# EAGLE design PitotCTRLboard3 (EAGLE 9.6.2)
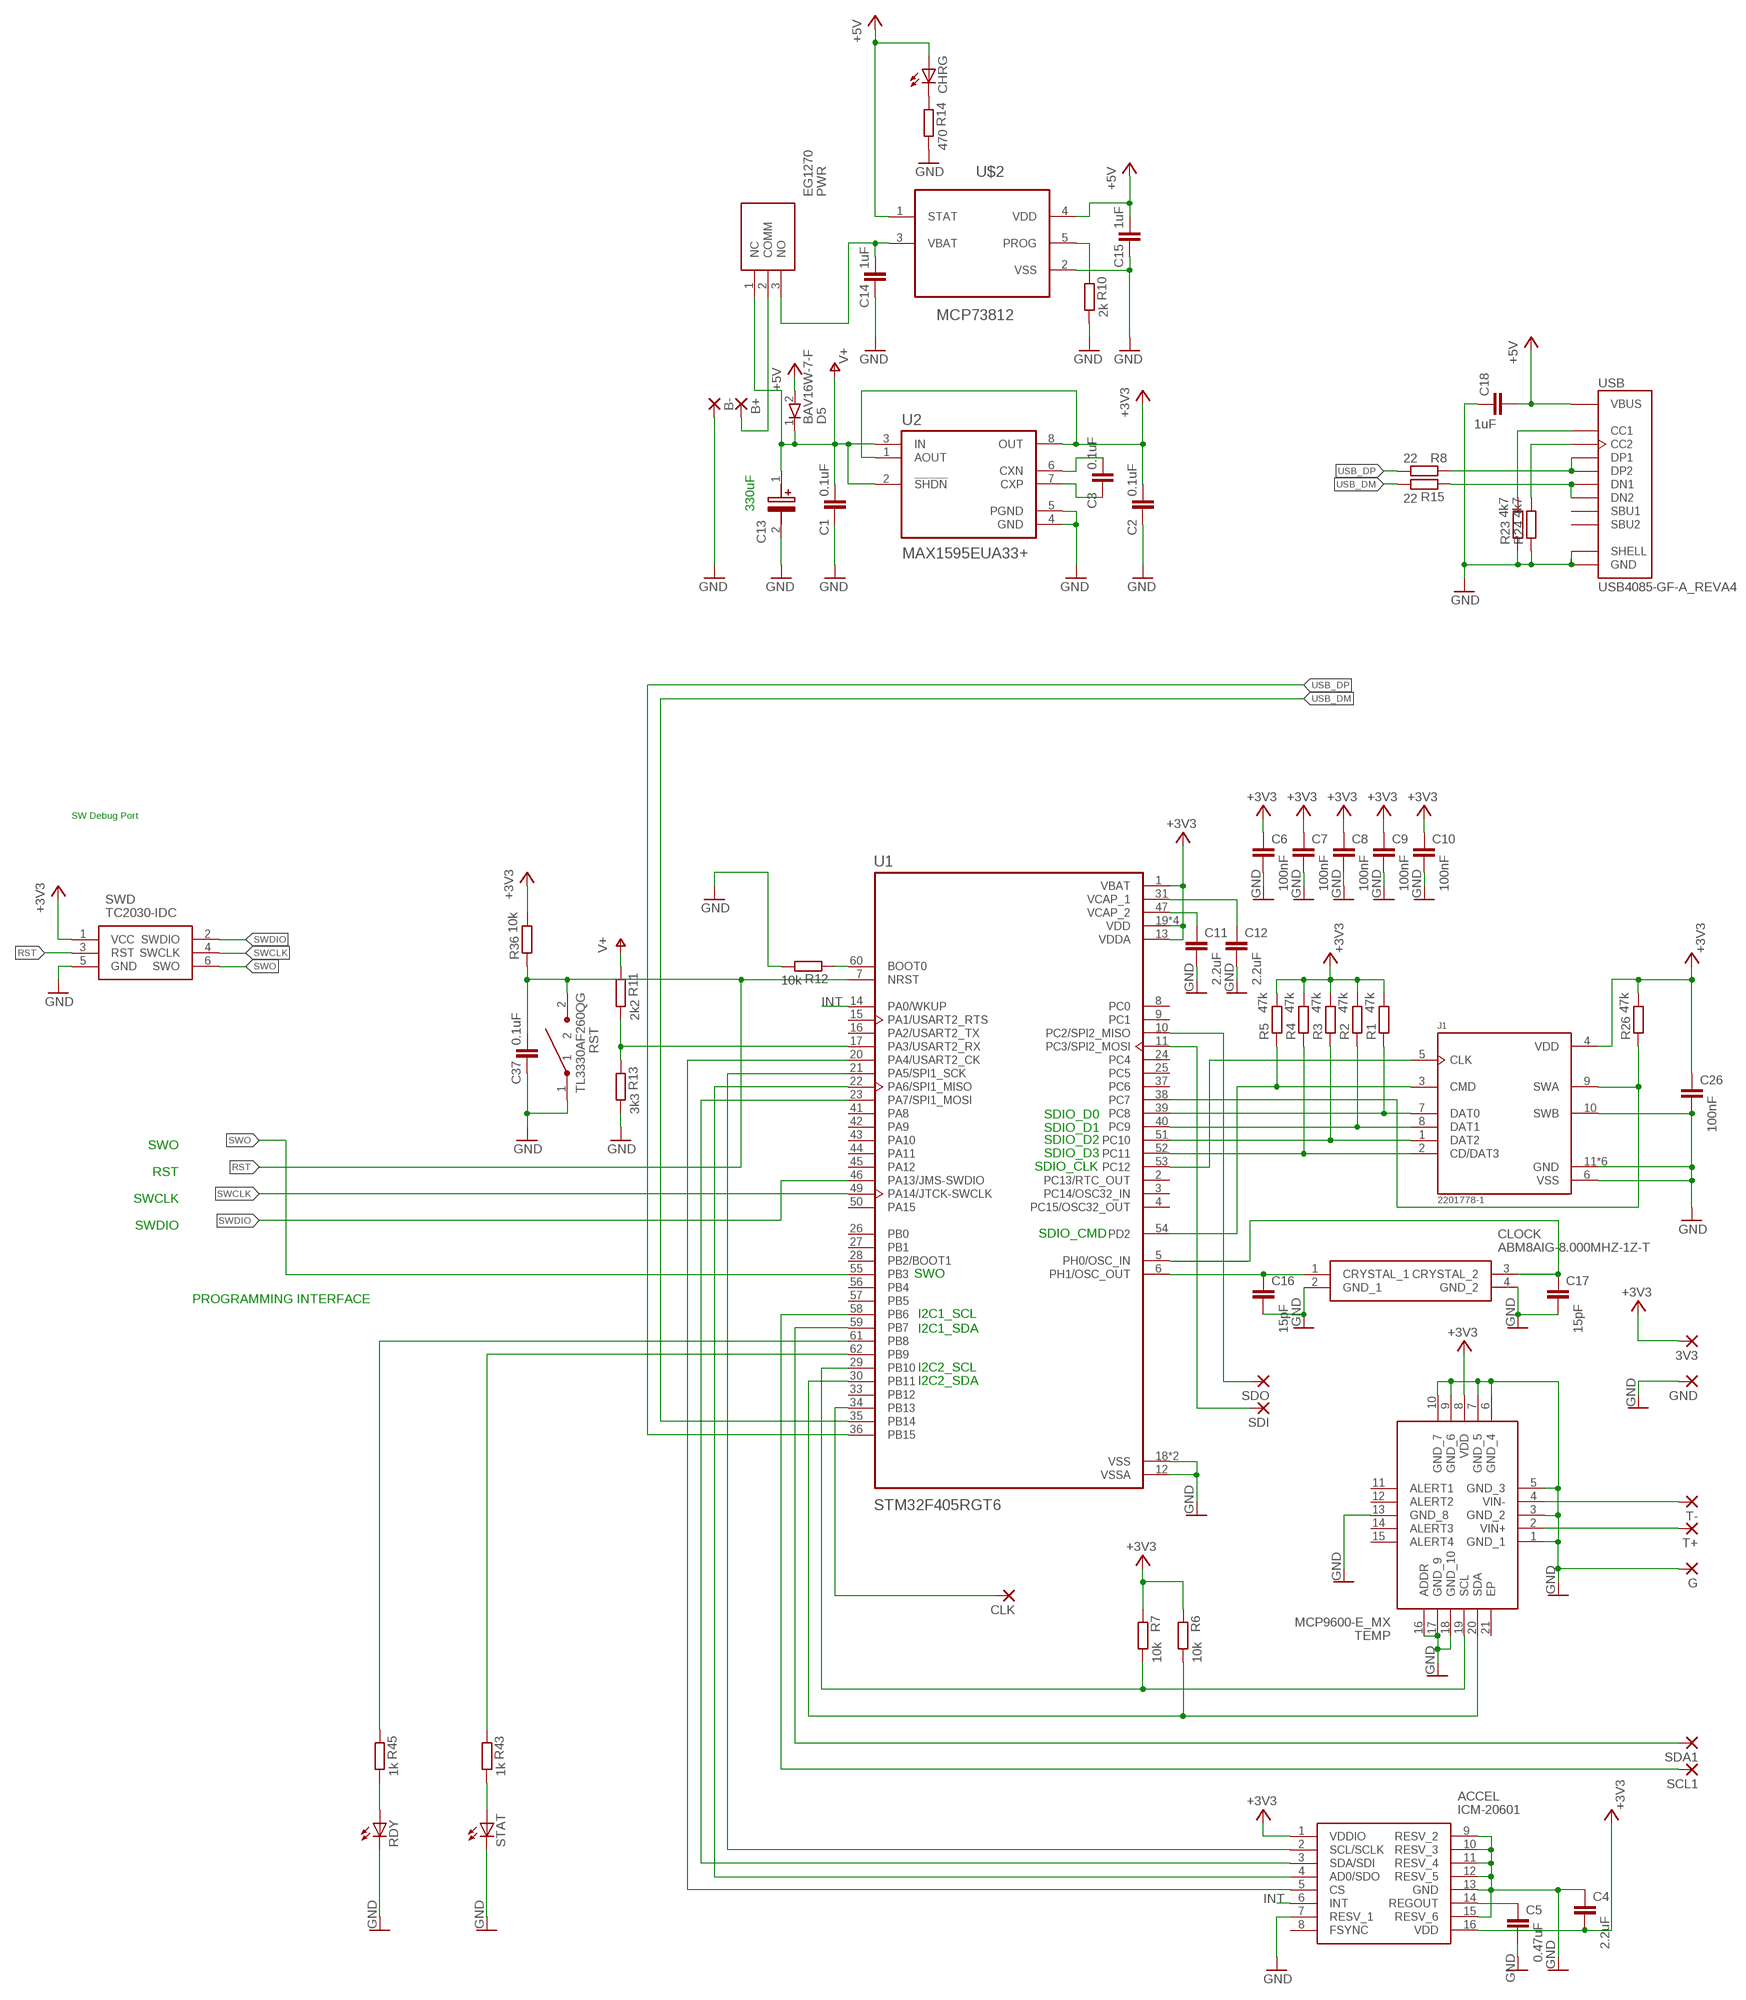
[diagram p0: schematic, sheet 1]

## Parts
3V3  SMD2  [SMD1,27-2,54]
ACCEL  ICM-20601  [PULL-BACK-QFN-16]
B+  1,6/0,9  [1,6/0,9]
B-  1,6/0,9  [1,6/0,9]
C1  0.1uF  C-EUC0603K  [C0603K]
C2  0.1uF  C-EUC0603K  [C0603K]
C3  0.1uF  C-EUC0603K  [C0603K]
C4  2.2uF  C-EUC0603K  [C0603K]
C5  0.47uF  C-EUC0603K  [C0603K]
C6  100nF  C-EUC0603K  [C0603K]
C7  100nF  C-EUC0603K  [C0603K]
C8  100nF  C-EUC0603K  [C0603K]
C9  100nF  C-EUC0603K  [C0603K]
C10  100nF  C-EUC0603K  [C0603K]
C11  2.2uF  C-EUC0603K  [C0603K]
C12  2.2uF  C-EUC0603K  [C0603K]
C13  330uF  T491C106K035AT  [CAPPM6032X280N]
C14  1uF  C-EUC0603K  [C0603K]
C15  1uF  C-EUC0603K  [C0603K]
C16  15pF  C-EUC0603K  [C0603K]
C17  15pF  C-EUC0603K  [C0603K]
C18  1uF  C-EUC0603K  [C0603K]
C26  100nF  C-EUC0603K  [C0603K]
C37  0.1uF  C-EUC0603K  [C0603K]
CHRG  LEDCHIPLED_0805  [CHIPLED_0805]
CLK  SMD2  [SMD1,27-2,54]
CLOCK  ABM8AIG-8.000MHZ-1Z-T  [ABM8AIG8000MHZ1ZT]
D5  BAV16W-7-F  [SOD3716X145N]
G  1,6/0,9  [1,6/0,9]
GND  SMD2  [SMD1,27-2,54]
J1  2201778-1  [TE_2201778-1]
PWR  EG1270  [EG1270]
R1  47k  R-EU_R0603  [R0603]
R2  47k  R-EU_R0603  [R0603]
R3  47k  R-EU_R0603  [R0603]
R4  47k  R-EU_R0603  [R0603]
R5  47k  R-EU_R0603  [R0603]
R6  10k  R-EU_R0603  [R0603]
R7  10k  R-EU_R0603  [R0603]
R8  22  R-EU_R0603  [R0603]
R10  2k  R-EU_R0603  [R0603]
R11  2k2  R-EU_R0603  [R0603]
R12  10k  R-EU_R0603  [R0603]
R13  3k3  R-EU_R0603  [R0603]
R14  470  R-EU_R0603  [R0603]
R15  22  R-EU_R0603  [R0603]
R23  4k7  R-EU_R0603  [R0603]
R24  4k7  R-EU_R0603  [R0603]
R26  47k  R-EU_R0603  [R0603]
R36  10k  R-EU_R0603  [R0603]
R43  1k  R-EU_R0603  [R0603]
R45  1k  R-EU_R0603  [R0603]
RDY  LEDCHIPLED_0805  [CHIPLED_0805]
RST  TL3330AF260QG  [TL3330]
SCL1  SMD2  [SMD1,27-2,54]
SDA1  SMD2  [SMD1,27-2,54]
SDI  SMD2  [SMD1,27-2,54]
SDO  SMD2  [SMD1,27-2,54]
STAT  LEDCHIPLED_0805  [CHIPLED_0805]
SWD  TC2030-IDC  [TC2030IDC]
T+  1,6/0,9  [1,6/0,9]
T-  1,6/0,9  [1,6/0,9]
TEMP  MCP9600-E_MX  [QFN65P500X500X100-21N]
U1  STM32F405RGT6  [QFP50P1200X1200X160-64N]
U2  MAX1595EUA33+  [SOP65P490X110-8N]
U$2  MCP73812  MCP73831T-2ACI/OT  [SOT95P280X145-5N]
USB  USB4085-GF-A_REVA4  [GCT_USB4085-GF-A_REVA4]

## Nets
+3V3: 3V3.1(P) ACCEL.1(VDDIO) ACCEL.16(VDD) C2.1 C4.2 C6.1 C7.1 C8.1 C9.1 C10.1 C26.1 J1.4(VDD) R1.2 R2.2 R3.2 R4.2 R5.2 R6.1 R7.1 R26.2 R36.2 SWD.1(VCC) TEMP.8(VDD) U1.1(VBAT) U1.13(VDDA) U1.19(VDD) U1.32(VDD) U1.48(VDD) U1.64(VDD) U2.1(AOUT) U2.8(OUT)
+5V: C15.1 C18.2 CHRG.A D5.2(A) U$2.1(STAT) U$2.4(VDD) USB.A4(VBUS) USB.A9(VBUS) USB.B4(VBUS) USB.B9(VBUS)
GND: ACCEL.7(RESV_1) ACCEL.9(RESV_2) ACCEL.10(RESV_3) ACCEL.11(RESV_4) ACCEL.12(RESV_5) ACCEL.13(GND) ACCEL.15(RESV_6) B-.1(P) C1.2 C2.2 C4.1 C5.2 C6.2 C7.2 C8.2 C9.2 C10.2 C11.2 C12.2 C13.2(-) C14.2 C15.2 C16.2 C17.2 C18.1 C26.2 C37.2 CLOCK.2(GND_1) CLOCK.4(GND_2) G.1(P) GND.1(P) J1.6(VSS) J1.10(SWB) J1.11(GND) J1.12(GND) J1.13(GND) J1.14(GND) J1.15(GND) J1.16(GND) R10.2 R12.2 R13.2 R14.2 R23.1 R24.1 RDY.C RST.1 STAT.C SWD.5(GND) TEMP.1(GND_1) TEMP.3(GND_2) TEMP.5(GND_3) TEMP.6(GND_4) TEMP.7(GND_5) TEMP.9(GND_6) TEMP.10(GND_7) TEMP.13(GND_8) TEMP.16(ADDR) TEMP.17(GND_9) TEMP.18(GND_10) U1.12(VSSA) U1.18(VSS) U1.63(VSS) U2.4(GND) U2.5(PGND) U$2.2(VSS) USB.A1(GND) USB.A12(GND) USB.B1(GND) USB.B12(GND) USB.P1(SHELL) USB.P2(SHELL) USB.P3(SHELL) USB.P4(SHELL)
INT: ACCEL.6(INT) U1.14(PA0/WKUP)
N$1: T-.1(P) TEMP.4(VIN-)
N$2: T+.1(P) TEMP.2(VIN+)
N$3: SDA1.1(P) U1.59(PB7)
N$4: SCL1.1(P) U1.58(PB6)
N$5: J1.7(DAT0) R1.1 U1.39(PC8)
N$6: J1.8(DAT1) R2.1 U1.40(PC9)
N$7: J1.1(DAT2) R3.1 U1.51(PC10)
N$8: J1.2(CD/DAT3) R4.1 U1.52(PC11)
N$9: J1.3(CMD) R5.1 U1.54(PD2)
N$10: R7.2 TEMP.19(SCL) U1.29(PB10)
N$11: R6.2 TEMP.20(SDA) U1.30(PB11)
N$12: ACCEL.2(SCL/SCLK) U1.21(PA5/SPI1_SCK)
N$14: ACCEL.4(AD0/SDO) U1.22(PA6/SPI1_MISO)
N$15: ACCEL.3(SDA/SDI) U1.23(PA7/SPI1_MOSI)
N$17: ACCEL.5(CS) U1.20(PA4/USART2_CK)
N$18: J1.5(CLK) U1.53(PC12)
N$19: R12.1 U1.60(BOOT0)
N$20: R43.2 STAT.A
N$21: R43.1 U1.62(PB9)
N$22: R45.1 U1.61(PB8)
N$23: C17.1 CLOCK.3(CRYSTAL_2) U1.5(PH0/OSC_IN)
N$24: B+.1(P) PWR.2(COMM)
N$25: C3.1 U2.6(CXN)
N$26: C3.2 U2.7(CXP)
N$31: ACCEL.14(REGOUT) C5.1
N$33: C12.1 U1.31(VCAP_1)
N$34: C11.1 U1.47(VCAP_2)
N$36: R10.1 U$2.5(PROG)
N$37: R11.2 R13.1 U1.17(PA3/USART2_RX)
N$38: C14.1 PWR.3(NO) U$2.3(VBAT)
N$39: C16.1 CLOCK.1(CRYSTAL_1) U1.6(PH1/OSC_OUT)
N$40: R8.1 USB.A6(DP1) USB.B6(DP2)
N$41: CHRG.C R14.1
N$42: SDO.1(P) U1.10(PC2/SPI2_MISO)
N$43: SDI.1(P) U1.11(PC3/SPI2_MOSI)
N$44: CLK.1(P) U1.34(PB13)
N$46: R24.2 USB.B5(CC2)
N$47: R23.2 USB.A5(CC1)
N$51: R45.2 RDY.A
N$52: R15.1 USB.A7(DN1) USB.B7(DN2)
N$71: J1.9(SWA) R26.1 U1.38(PC7)
RST: C37.1 R36.1 RST.2 SWD.3(RST) U1.7(NRST)
SWCLK: SWD.4(SWCLK) U1.49(PA14/JTCK-SWCLK)
SWDIO: SWD.2(SWDIO) U1.46(PA13/JMS-SWDIO)
SWO: SWD.6(SWO) U1.55(PB3)
USB_DM: R15.2 U1.35(PB14)
USB_DP: R8.2 U1.36(PB15)
V+: C1.1 C13.1(+) D5.1(K) PWR.1(NC) R11.1 U2.2(!SHDN) U2.3(IN)
Unconnected: ACCEL.8(FSYNC) TEMP.11(ALERT1) TEMP.12(ALERT2) TEMP.14(ALERT3) TEMP.15(ALERT4) TEMP.21(EP) U1.2(PC13/RTC_OUT) U1.3(PC14/OSC32_IN) U1.4(PC15/OSC32_OUT) U1.8(PC0) U1.9(PC1) U1.15(PA1/USART2_RTS) U1.16(PA2/USART2_TX) U1.24(PC4) U1.25(PC5) U1.26(PB0) U1.27(PB1) U1.28(PB2/BOOT1) U1.33(PB12) U1.37(PC6) U1.41(PA8) U1.42(PA9) U1.43(PA10) U1.44(PA11) U1.45(PA12) U1.50(PA15) U1.56(PB4) U1.57(PB5) USB.A8(SBU1) USB.B8(SBU2)

## Notes on the sheet
- 330uF
- SW Debug Port
- SDIO_D0
- SDIO_D1
- SWO
- SDIO_D2
- SDIO_D3
- RST
- SDIO_CLK
- SWCLK
- SWDIO
- SDIO_CMD
- SWO
- PROGRAMMING INTERFACE
- I2C1_SCL
- I2C1_SDA
- I2C2_SCL
- I2C2_SDA

## Library data of the parts
3V3 CLK GND SCL1 SDA1 SDI SDO = wirepad:SMD2: SMD PAD
ACCEL = ICM-20601:ICM-20601: IMU ACCEL/GYRO/TEMP I2C/SPI LGA Source: Datasheet <http://www.invensense.com/wp-content/uploads/2015/12/DS-000191-ICM-20601-v1.0.pdf>; DESCRIPTION: IMU ACCEL/GYRO/TEMP I2C/SPI LGA; HEIGHT: mm; MANUFACTURER_NAME: InvenSense Inc.; MANUFACTURER_PART_NUMBER: ICM-20601; MOUSER_PART_NUMBER: 410-ICM-20601; MOUSER_PRICE-STOCK: https://www.mouser.com/Search/Refine.aspx?Keyword=410-ICM-20601
B+ B- G T+ T- = wirepad:1,6/0,9: THROUGH-HOLE PAD
C1-C12 C14-C18 C26 C37 = rcl:C-EU: CAPACITOR, European symbol; SPICEPREFIX: C
C13 = T491C106K035AT:T491C106K035AT: KEMET 10uF 35V dc Tantalum Capacitor MnO2 Solid +/-10% Tolerance T491 Series Source: Datasheet <https://content.kemet.com/datasheets/KEM_T2005_T491.pdf>; ALLIED_NUMBER: 70610893; ALLIED_PRICE-STOCK: https://www.alliedelec.com/kemet-t491c106k035at/70610893/; DESCRIPTION: KEMET 10uF 35V dc Tantalum Capacitor MnO2 Solid +/-10% Tolerance T491 Series; HEIGHT: 2.8mm; MANUFACTURER_NAME: Kemet; MANUFACTURER_PART_NUMBER: T491C106K035AT; MOUSER_PART_NUMBER: 80-T491C106K035; MOUSER_PRICE-STOCK: https://www.mouser.com/Search/Refine.aspx?Keyword=80-T491C106K035; RS_PART_NUMBER: 8015520; RS_PRICE-STOCK: https://uk.rs-online.com/web/p/products/8015520
CHRG RDY STAT = led:LED: LED OSRAM: - CHIPLED LG R971, LG N971, LY N971, LG Q971, LY Q971, LO R971, LY R971 LH N974, LH R974 LS Q976, LO Q976, LY Q976 LO Q996 - Hyper CHIPLED LW Q18S LB Q993, LB Q99A, LB R99A - SideLED LS A670, LO A670, LY A670, LG A670, LP A670 LB A673, LV A673, LT A673, LW A673 LH A674 LY A675 LS A676, LA A676, LO A676, LY A676, LW A676 LS A679, LY A679, LG A679 - Hyper Micro SIDELED® LS Y876, LA Y876, LO Y876, LY Y876 LT Y87S - SmartLED LW L88C, LW L88S LB L89C, LB L89S, LG L890 LS L89K, LO L89K, LY L89K LS L896, LA L896, LO L896, LY L896 - TOPLED LS T670, LO T670, LY T670, LG T670, LP T670 LSG T670, LSP T670, LSY T670, LOP T670, LYG T670 LG T671, LOG T671, LSG T671 LB T673, LV T673, LT T673, LW T673 LH T674 LS T676, LA T676, LO T676, LY T676, LB T676, LH T676, LSB T676, LW T676 LB T67C, LV T67C, LT T67C, LS T67K, LO T67K, LY T67K, LW E67C LS E67B, LA E67B, LO E67B, LY E67B, LB E67C, LV E67C, LT E67C LW T67C LS T679, LY T679, LG T679 LS T770, LO T770, LY T770, LG T770, LP T770 LB T773, LV T773, LT T773, LW T773 LH T774 LS E675, LA E675, LY E675, LS T675 LS T776, LA T776, LO T776, LY T776, LB T776 LHGB T686 LT T68C, LB T68C - Hyper Mini TOPLED® LB M676 - Mini TOPLED Santana® LG M470 LS M47K, LO M47K, LY M47K Source: http://www.osram.convergy.de LUXEON: - LUMILED® LXK2-PW12-R00, LXK2-PW12-S00, LXK2-PW14-U00, LXK2-PW14-V00 LXK2-PM12-R00, LXK2-PM12-S00, LXK2-PM14-U00 LXK2-PE12-Q00, LXK2-PE12-R00, LXK2-PE12-S00, LXK2-PE14-T00, LXK2-PE14-U00 LXK2-PB12-K00, LXK2-PB12-L00, LXK2-PB12-M00, LXK2-PB14-N00, LXK2-PB14-P00, LXK2-PB14-Q00 LXK2-PR12-L00, LXK2-PR12-M00, LXK2-PR14-Q00, LXK2-PR14-R00 LXK2-PD12-Q00, LXK2-PD12-R00, LXK2-PD12-S00 LXK2-PH12-R00, LXK2-PH12-S00 LXK2-PL12-P00, LXK2-PL12-Q00, LXK2-PL12-R00 Source: www.luxeon.com KINGBRIGHT: KA-3528ASYC Source: www.kingbright.com
CLOCK = ABM8AIG-8.000MHZ-1Z-T:ABM8AIG-8.000MHZ-1Z-T: Crystals 18pF 8MHz 10ppm AEC-Q200 -40C +125C Source: Datasheet <https://abracon.com/AIGcrystals/ABM8AIG.pdf>; DESCRIPTION: Crystals 18pF 8MHz 10ppm AEC-Q200 -40C +125C; HEIGHT: 0.8mm; MANUFACTURER_NAME: ABRACON; MANUFACTURER_PART_NUMBER: ABM8AIG-8.000MHZ-1Z-T; MOUSER_PART_NUMBER: 815-M8AIG-8-1ZT; MOUSER_PRICE-STOCK: https://www.mouser.com/Search/Refine.aspx?Keyword=815-M8AIG-8-1ZT
D5 = BAV16W-7-F:BAV16W-7-F: Diode Switching 100V 0.15A 2Pin SOD123 Diodes Inc BAV16W-7-F Switching Diode, 300mA 100V, 2-Pin SOD-123 Source: Datasheet <http://docs-emea.rs-online.com/webdocs/104c/0900766b8104c76b.pdf>; ALLIED_NUMBER: 70437641; ALLIED_PRICE-STOCK: http://www.alliedelec.com/diodes-inc-bav16w-7-f/70437641/; DESCRIPTION: Diode Switching 100V 0.15A 2Pin SOD123 Diodes Inc BAV16W-7-F Switching Diode, 300mA 100V, 2-Pin SOD-123; HEIGHT: 1.45mm; MANUFACTURER_NAME: Diodes Inc.; MANUFACTURER_PART_NUMBER: BAV16W-7-F; MOUSER_PART_NUMBER: 621-BAV16W-F; MOUSER_PRICE-STOCK: https://www.mouser.com/Search/Refine.aspx?Keyword=621-BAV16W-F; RS_PART_NUMBER: 7513430P; RS_PRICE-STOCK: http://uk.rs-online.com/web/p/products/7513430P
J1 = 2201778-1:2201778-1: MICRO SD PUSH PUSH LOW PROFILE TYPE; MANUFACTURER: TE Connectivity; PARTREV: B; STANDARD: Manufacturer recommendations
PWR = EG1270:EG1270: E-SWITCH - EG1270 - SWITCH, SLIDE, SPDT, 300mA, 6V, PCB Source: Datasheet <https://componentsearchengine.com/Datasheets/1/EG1270.pdf>; ARROW_PART_NUMBER: EG1270; DESCRIPTION: E-SWITCH - EG1270 - SWITCH, SLIDE, SPDT, 300mA, 6V, PCB; HEIGHT: 4.6mm; MANUFACTURER_NAME: E-Switch; MANUFACTURER_PART_NUMBER: EG1270; MOUSER_PART_NUMBER: 612-EG1270; MOUSER_PRICE-STOCK: https://www.mouser.co.uk/ProductDetail/E-Switch/EG1270?qs=xDsBkp9LkodMM2ilVTltow%3D%3D
R1-R8 R10-R15 R23 R24 R26 R36 R43 R45 = rcl:R-EU_: RESISTOR, European symbol; SPICEPREFIX: R
RST = TL3330AF260QG:TL3330AF260QG: Tactile Switches 50mA@12VDC 260g OF Silver contacts Source: Datasheet <https://www.e-switch.com/system/asset/product_line/data_sheet/163/TL3330.pdf>; DESCRIPTION: Tactile Switches 50mA@12VDC 260g OF Silver contacts; HEIGHT: mm; MANUFACTURER_NAME: E-Switch; MANUFACTURER_PART_NUMBER: TL3330AF260QG; MOUSER_PART_NUMBER: 612-TL3330AF260QG; MOUSER_PRICE-STOCK: https://www.mouser.co.uk/ProductDetail/E-Switch/TL3330AF260QG?qs=cyOInwlKnROnXHK5BnOqnQ%3D%3D
SWD = TC2030-IDC:TC2030-IDC: CABLE ADAPTER 6 POS Source: Datasheet <http://www.tag-connect.com/Materials/TC2030-IDC.pdf>; DESCRIPTION: CABLE ADAPTER 6 POS; HEIGHT: 19mm; MANUFACTURER_NAME: Tag Connect; MANUFACTURER_PART_NUMBER: TC2030-IDC
TEMP = MCP9600-E_MX:MCP9600-E_MX: Board Mount Temperature Sensors Thermocouple to I2C converter Source: Datasheet <http://ww1.microchip.com/downloads/en/DeviceDoc/MCP9600-Data-Sheet-DS20005426D.pdf>; DESCRIPTION: Board Mount Temperature Sensors Thermocouple to I2C converter; HEIGHT: 1mm; MANUFACTURER_NAME: Microchip; MANUFACTURER_PART_NUMBER: MCP9600-E/MX; MOUSER_PART_NUMBER: 579-MCP9600-E/MX; MOUSER_PRICE-STOCK: https://www.mouser.com/Search/Refine.aspx?Keyword=579-MCP9600-E%2FMX; RS_PART_NUMBER: 1717832P; RS_PRICE-STOCK: http://uk.rs-online.com/web/p/products/1717832P
U1 = STM32F405RGT6:STM32F405RGT6: High-performance foundation line, ARM Cortex-M4 core with DSP and FPU, 1 Mbyte Flash, 168 MHz CPU, ART Accelerator; AVAILABILITY: Unavailable; DESCRIPTION: ARM® Cortex®-M4 STM32F4 Microcontroller IC 32-Bit 168MHz 1MB (1M x 8) FLASH 64-LQFP (10x10); MF: STMicroelectronics; MP: STM32F405RGT6; PACKAGE: LQFP-64 STMicroelectronics; PRICE: None
U2 = MAX1595EUA33_:MAX1595EUA33+: None; AVAILABILITY: Unavailable; DESCRIPTION: Charge Pump Switching Regulator IC Positive Fixed 3.3V 1 Output 125mA 8-TSSOP, 8-MSOP (0.118, 3.00mm Width); MF: Maxim Integrated; MP: MAX1595EUA33; PACKAGE: None; PRICE: None
U$2 = MCP73831T-2ACI_OT:MCP73831T-2ACI/OT: Charge Management Controller Buy Part <https://snapeda.com/parts/MCP73831T-2ACI/OT/Microchip/view-part/?ref=eda>; AVAILABILITY: Warning; DESCRIPTION: Charger IC Lithium Ion/Polymer SOT-23-5; DIGIKEY-PURCHASE-URL: https://snapeda.com/shop?store=DigiKey&id=53208; MF: Microchip; MOUSER-PURCHASE-URL: https://snapeda.com/shop?store=Mouser&id=53208; MP: MCP73831T-2ACI/OT; PACKAGE: SOT-23 Microchip; PRICE: None
USB = USB4085-GF-A_REVA4:USB4085-GF-A_REVA4: USB 2.0 Type C Receptacle Dip Type, PCB Top Mount Check prices <https://pricing.snapeda.com/parts/USB4085-GF-A/Global%20Connector%20Technology/view-part?ref=eda>; AVAILABILITY: In Stock; DESCRIPTION: USB-C (USB TYPE-C) USB 2.0 Receptacle Connector 24 (16+8 Dummy) Position Through Hole, Right Angle, low cost, 3.46mm profile, 16 pin, horizontal, Top mount; MF: Global Connector Technology; MP: USB4085-GF-A; PACKAGE: None; PRICE: None; PURCHASE-URL: https://pricing.snapeda.com/search/part/USB4085-GF-A/?ref=eda

## Board
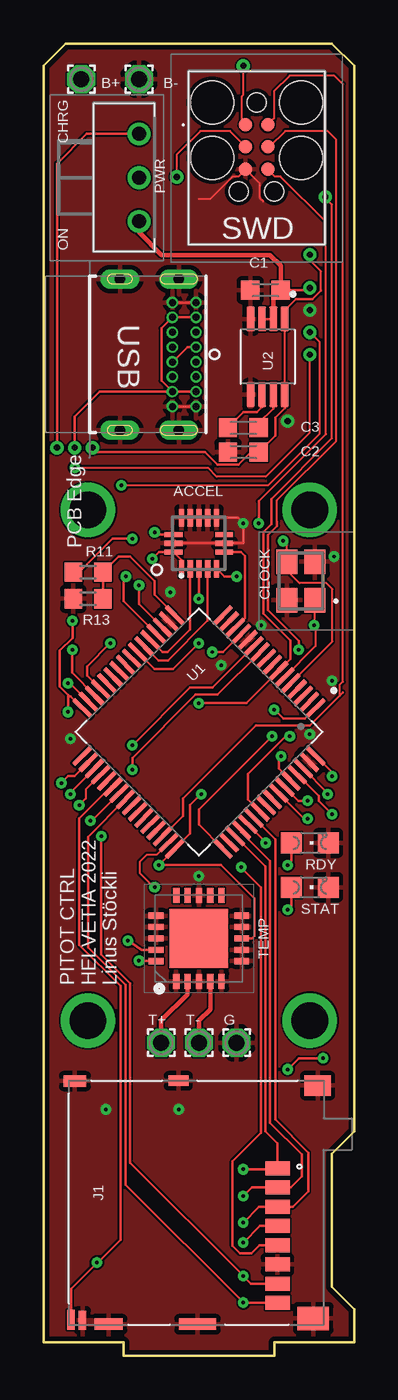
[diagram p1: board, top side]
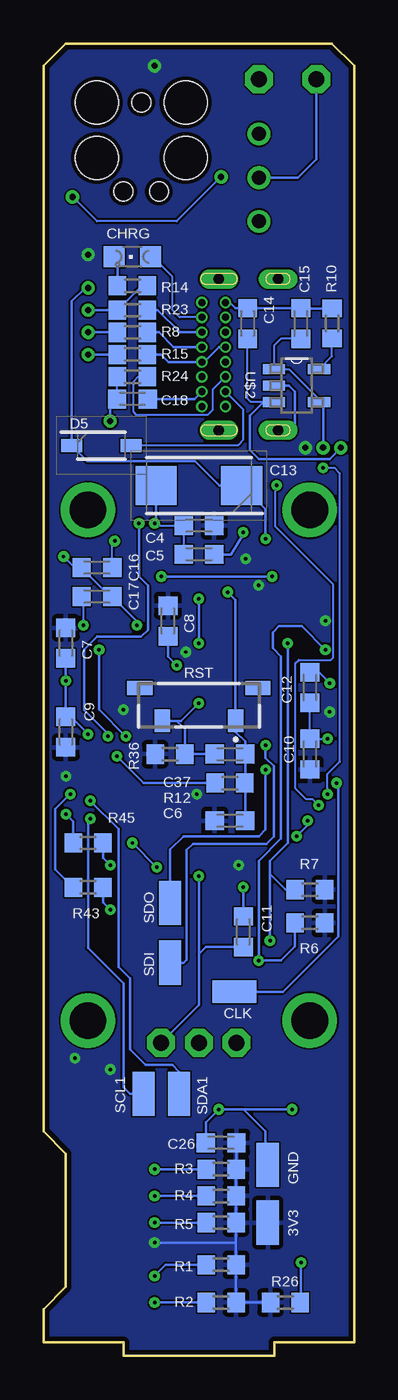
[diagram p2: board, bottom side, seen from below]

Size 17.78 x 75.06 mm. Coordinates in mm from the lower left corner, seen from the top.
Outline: 4.57,0 13.21,0 13.21,0.76 17.78,0.76 17.78,2.67 16.51,3.94 16.51,11.56 17.78,12.83 17.78,73.79 16.51,75.06 1.27,75.06 0,73.79 0,0.76 4.57,0.76 4.57,0
Copper layers (1*16): Top 0.035mm / dielectric 1.5mm / Bottom 0.035mm
Design rules "default *": minimum track width 4mil, minimum drill 0.2mm, track to track 4mil, track to pad 4mil, pad to pad 4mil, via to via 4mil, smd to smd 4mil, copper to edge 10mil, drill to drill 4mil, minimum pad ring 4mil, minimum via ring 8mil, stop-mask expansion 4mil, vias tented up to drill 0mil, thermal gap 10mil

### Footprints (pad centres in the part's own frame; a part is rotated, then mirrored left to right if it is on the bottom)
SMD1,27-2,54 = smd 1.27 x 2.54: 1 0,0
PULL-BACK-QFN-16 = smd 1.008 x 0.3: 1 -1.454,1; 2 -1.454,0.5; 3 -1.454,0; 4 -1.454,-0.5; 5 -1.454,-1; 9 1.454,-1; 10 1.454,-0.5; 11 1.454,0; 12 1.454,0.5; 13 1.454,1 | smd 0.3 x 1.008: 6 -0.5,-1.454; 7 0,-1.454; 8 0.5,-1.454; 14 0.5,1.454; 15 0,1.454; 16 -0.5,1.454
1,6/0,9 = drill 0.914 pad 1.6 octagon: 1 0,0
C0603K = smd 1.05 x 1.08: 1 -0.875,0; 2 0.875,0
CAPPM6032X280N = smd 2.35 x 2.25: 1 -2.45,0; 2 2.45,0
CHIPLED_0805 = smd 1.2 x 1.2: A 0,-1.05; C 0,1.05
ABM8AIG8000MHZ1ZT = smd 1.4 x 1.2: 1 -1.1,-0.8; 2 1.1,-0.8; 3 1.1,0.8; 4 -1.1,0.8
SOD3716X145N = smd 1.2 x 0.75: 1 -1.7,0; 2 1.7,0
TE_2201778-1 = smd 0.8 x 1.4: 1 1.965,-4.75; 2 0.865,-4.75; 3 -0.235,-4.75; 4 -1.335,-4.75; 5 -2.435,-4.75; 6 -3.535,-4.75; 7 -4.635,-4.75; 8 -5.735,-4.75 | smd 1.15 x 0.45: 9 -6.7,7.075 | smd 1.1 x 0.45: 10 -6.725,6.415 | smd 1.35 x 1.8: 11 -6.625,-6.8 | smd 0.65 x 2.14: 12 -6.95,-0.17 | smd 0.65 x 1.6: 13 -6.95,4.91 | smd 0.65 x 1.3: 14 6.95,6.85 | smd 0.6 x 1.15: 15 6.975,0.925 | smd 1.16 x 1.5: 16 6.695,-7.05
EG1270 = drill 0.8 pad 1.3: 1 0,0; 2 0,2.5; 3 0,5
R0603 = smd 1 x 1.1: 1 -0.85,0; 2 0.85,0
TL3330 = smd 0.9 x 1.27: 1 -2.1,0.885; 2 2.1,0.885 | smd 1.45 x 0.8: 3 -3.375,-1; 4 3.375,-1
TC2030IDC = smd 0.783 x 0.783: 1 -0.953,-0.635; 2 -0.953,0.635; 3 0.317,-0.635; 4 0.317,0.635; 5 1.588,-0.635; 6 1.588,0.635 | hole 2.451: -2.223,-2.54; -2.223,2.54; 0.952,-2.54; 0.952,2.54 | hole 1.067: -2.223,0; 2.857,-1.016; 2.857,1.016
QFN65P500X500X100-21N = smd 0.85 x 0.35: 1 -2.45,1.3; 2 -2.45,0.65; 3 -2.45,0; 4 -2.45,-0.65; 5 -2.45,-1.3; 11 2.45,-1.3; 12 2.45,-0.65; 13 2.45,0; 14 2.45,0.65; 15 2.45,1.3 | smd 0.35 x 0.85: 6 -1.3,-2.45; 7 -0.65,-2.45; 8 0,-2.45; 9 0.65,-2.45; 10 1.3,-2.45; 16 1.3,2.45; 17 0.65,2.45; 18 0,2.45; 19 -0.65,2.45; 20 -1.3,2.45 | smd 3.35 x 3.35: 21 0,0
QFP50P1200X1200X160-64N = smd 1.47 x 0.28: 1 -5.67,3.75; 2 -5.67,3.25; 3 -5.67,2.75; 4 -5.67,2.25; 5 -5.67,1.75; 6 -5.67,1.25; 7 -5.67,0.75; 8 -5.67,0.25; 9 -5.67,-0.25; 10 -5.67,-0.75; 11 -5.67,-1.25; 12 -5.67,-1.75; 13 -5.67,-2.25; 14 -5.67,-2.75; 15 -5.67,-3.25; 16 -5.67,-3.75; 33 5.67,-3.75; 34 5.67,-3.25; 35 5.67,-2.75; 36 5.67,-2.25; 37 5.67,-1.75; 38 5.67,-1.25; 39 5.67,-0.75; 40 5.67,-0.25; 41 5.67,0.25; 42 5.67,0.75; 43 5.67,1.25; 44 5.67,1.75; 45 5.67,2.25; 46 5.67,2.75; 47 5.67,3.25; 48 5.67,3.75 | smd 0.28 x 1.47: 17 -3.75,-5.67; 18 -3.25,-5.67; 19 -2.75,-5.67; 20 -2.25,-5.67; 21 -1.75,-5.67; 22 -1.25,-5.67; 23 -0.75,-5.67; 24 -0.25,-5.67; 25 0.25,-5.67; 26 0.75,-5.67; 27 1.25,-5.67; 28 1.75,-5.67; 29 2.25,-5.67; 30 2.75,-5.67; 31 3.25,-5.67; 32 3.75,-5.67; 49 3.75,5.67; 50 3.25,5.67; 51 2.75,5.67; 52 2.25,5.67; 53 1.75,5.67; 54 1.25,5.67; 55 0.75,5.67; 56 0.25,5.67; 57 -0.25,5.67; 58 -0.75,5.67; 59 -1.25,5.67; 60 -1.75,5.67; 61 -2.25,5.67; 62 -2.75,5.67; 63 -3.25,5.67; 64 -3.75,5.67
SOP65P490X110-8N = smd 1.42 x 0.47: 1 -2.165,0.975; 2 -2.165,0.325; 3 -2.165,-0.325; 4 -2.165,-0.975; 5 2.165,-0.975; 6 2.165,-0.325; 7 2.165,0.325; 8 2.165,0.975
SOT95P280X145-5N = smd 1.27 x 0.559: 1 -1.295,0.94; 2 -1.295,0; 3 -1.295,-0.94; 4 1.295,-0.94; 5 1.295,0.94
GCT_USB4085-GF-A_REVA4 = drill 0.4 pad 0.65: A1 -2.975,4.025; A4 -2.125,4.025; A5 -1.275,4.025; A6 -0.425,4.025; A7 0.425,4.025; A8 1.275,4.025; A9 2.125,4.025; A12 2.975,4.025; B1 2.975,2.675; B4 2.125,2.675; B5 1.275,2.675; B6 0.425,2.675; B7 -0.425,2.675; B8 -1.275,2.675; B9 -2.125,2.675; B12 -2.975,2.675 | drill 0.6 pad 1.108 long: P1 -4.325,3.045; P2 4.325,3.045; P3 4.325,-0.335; P4 -4.325,-0.335

### Placement (x,y rotation side)
3V3  4.95,7.62 0 bottom
ACCEL  8.89,46.48 90 top
B+  2.16,73.03 270 top
B-  5.46,73.03 90 top
C1  12.7,60.96 180 top
C2  11.43,51.69 180 top
C3  11.43,53.09 0 top
C4  8.89,47.5 0 bottom
C5  8.89,45.85 180 bottom
C6  7.11,30.61 0 bottom
C7  16.51,40.77 270 bottom
C8  10.67,42.04 270 bottom
C9  16.51,35.69 90 bottom
C10  2.54,34.42 90 bottom
C11  6.35,24.26 270 bottom
C12  2.54,38.23 270 bottom
C13  8.89,49.78 180 bottom
C14  6.1,59.05 90 bottom
C15  3.05,59.05 90 bottom
C16  14.73,43.43 0 bottom
C17  14.73,45.08 180 bottom
C18  12.7,54.74 0 bottom
C26  7.62,12.19 180 bottom
C37  7.11,34.42 0 bottom
CHRG  12.7,62.86 90 bottom
CLK  6.86,20.83 270 bottom
CLOCK  14.73,44.32 90 top
D5  14.48,52.07 0 bottom
G  11.05,17.91 0 top
GND  4.95,10.92 0 bottom
J1  8.64,8.76 90 top
PWR  5.46,64.9 0 top
R1  7.62,5.21 0 bottom
R2  7.62,3.05 0 bottom
R3  7.62,10.67 0 bottom
R4  7.62,9.14 0 bottom
R5  7.62,7.62 0 bottom
R6  2.54,24.76 180 bottom
R7  2.54,26.67 180 bottom
R8  12.7,58.55 180 bottom
R10  1.27,59.05 90 bottom
R11  2.54,44.83 0 top
R12  7.11,32.77 0 bottom
R13  2.54,43.31 180 top
R14  12.7,61.21 0 bottom
R15  12.7,57.28 180 bottom
R23  12.7,59.82 0 bottom
R24  12.7,56.01 0 bottom
R26  3.94,3.05 180 bottom
R36  10.54,34.42 180 bottom
R43  15.24,26.8 0 bottom
R45  15.24,29.34 0 bottom
RDY  15.24,29.34 270 top
RST  8.89,37.21 180 bottom
SCL1  12.07,14.99 0 bottom
SDA1  10.03,14.99 0 bottom
SDI  10.54,22.48 0 bottom
SDO  10.54,25.91 0 bottom
STAT  15.24,26.8 270 top
SWD  12.19,69.47 270 top
T+  6.73,17.91 0 top
T-  8.89,17.91 0 top
TEMP  8.89,23.88 90 top
U1  8.89,35.69 225 top
U2  12.83,57.15 270 top
U$2  3.3,55.5 0 bottom
USB  4.7,57.28 270 top

### Tracks (layer width: path | path; a pad name or v marks a point on that pad's centre or on a via)
+3V3  (via drill 0.2, 0.35)
  Top 0.127: U2.8 U2.1 13.8,59.82 14.44,60.46 | 15.88,60.96 15.88,62.04 15.24,62.67 v15.24,62.99 | v11.43,73.79 11.43,72.13 11.34,72.04 11.34,70.64 SWD.1
  Top 0.15: v1.4,36.83 1.4,37.8 0.92,38.28 0.92,40.33 1.65,41.06 v1.65,42.04 | v13.97,16.38 14.61,17.02 v16,17.02
  Top 0.152: J1.4 12.38,7.43 v11.43,6.48 | ACCEL.16 7.43,45.97 | v6.22,45.59 6.6,45.97 7.43,45.97 | ACCEL.1 7.89,45.51 7.43,45.97 | U1.1 14.96,36.45 13.72,36.45 v13.21,36.96 | TEMP.8 11.92,23.88 12.07,24.02 12.07,26.16 10.16,28.07 v6.6,28.07 7.53,28.99 U1.48 8.38,29.88 8.38,31.5 v9.02,32.13 | U1.13 10.28,40.26 v9.65,40.26 | U1.64 15.58,34.33 16.51,33.4 v16.51,33.15 | U1.19 5.46,43 v5.46,44.07 | U1.32 1.56,37.72 1.4,37.72 v1.4,36.83 | U2.8 13.8,54.22 13.26,53.68 13.26,52.65 C2.1 11.87,51.69 11.15,50.97 9.96,50.97 9.24,51.69 3.05,51.69 v2.79,51.94 | 14.44,60.46 15.4,60.46 15.88,60.94 15.88,60.96
  Bottom 0.152: R26.2 R2.2 R1.2 6.77,6.48 | 6.77,6.48 R5.2 R4.2 R3.2 6.75,10.69 C26.1 | v11.43,6.48 6.77,6.48 | C4.2 8.02,47.38
  pour Bottom: -8.86,-6.22 -2.71,81.91 21.46,81.91 21.46,-3.81 19.05,-6.22
+5V  (via drill 0.35)
  Top 0.152: USB.B4 USB.A9 | USB.A4 USB.B9 6.74,58.77 6.74,55.78 USB.B4 | v1.78,51.94 1.78,53.72 3.21,55.15 USB.B4
  Bottom 0.127: 12.68,52.07 D5.2 12.74,52.11 6.64,52.11 6.34,52.4 6.34,54.12 USB.B4 | USB.A4 10,59.4 10.41,59.82 10.41,61.72 11.56,62.86 CHRG.A | C15.1 4.19,58.18 4.6,57.77 U$2.1 3.73,56.44 2.01,54.71 U$2.4
  Bottom 0.152: USB.A9 9.14,54.74 C18.2 | U$2.4 1.78,54.33 v1.78,51.94
GND  (via drill 0.2, 0.35)
  Top 0.127: 8.89,66.17 9.53,66.17 10.82,67.46 11.14,67.46 SWD.5 12.36,67.08 12.36,66.26 12.58,66.04
  Top 0.152: U2.5 11.85,54.94 | ACCEL.13 ACCEL.12 ACCEL.11 ACCEL.10 ACCEL.9 11.12,47.94 v11.43,47.62 11.43,46.48 ACCEL.7 ACCEL.15 | CLOCK.4 13.93,43.27 13.97,43.31 | USB.B12 USB.A1 | USB.B1 USB.A12
  Bottom 0.127: C12.2 C10.2 1.54,35.29 v1.52,35.31 | C18.1 13.57,55.98 R24.1 | R23.1 12.15,61.21 R14.2 | v11.43,47.62 11.3,47.5 C4.1 C5.2
  Bottom 0.15: C16.2 13.98,43.43 15.61,45.06 C17.2 16,45.08 v16.64,45.72 16.68,45.72
  Bottom 0.152: 11.29,47.48 v11.43,47.62 11.34,47.71 C13.2 | v8.89,27.43 8.89,22.99 | 8.89,22.99 8.89,20.07 G.1 | v7.24,43.69 6.79,43.24 RST.1 6.79,35.69 6.24,35.14 C37.2 6.24,32.79 R12.2 6.24,32.74 C6.2 | C26.2 8.5,13.35 v7.75,14.1 6.35,14.1 | C11.2 8.5,23.38 8.89,22.99 | v15.24,35.56 16.24,36.56 C9.2 v16.51,38.61 C7.2 | C8.2 10.67,40 v10.16,39.5 | GND.1 5.08,11.05 5.08,12.83 6.35,14.1 | 6.35,14.1 v3.56,14.1 | R10.2 3.02,59.91 C15.2 C14.2 6.8,59.93 7.12,60.25 USB.B12 | U$2.2 3.74,55.5 3.4,55.17 3.4,53.28 3.73,52.95 USB.P3 | C18.1 13.97,54.34 v13.97,53.47 | R23.1 v15.24,59.82 | v12.45,41.78 12.45,42.02 C16.2
  pour Top: -5.08,-4.95 -5.08,80.14 22.86,80.14 22.86,-2.41 19.05,-6.22 -3.81,-6.22
INT
  Top 0.152: ACCEL.6 11.29,45.98 11.53,45.75 11.53,42.22 U1.14
N$1
  Top 0.254: TEMP.4 9.54,19.83 8.89,19.18 T-.1
N$2
  Top 0.254: T+.1 6.73,19.18 8.24,20.69 TEMP.2
N$3  (via drill 0.2)
  Top 0.152: U1.59 14.6,31.75 v15.11,31.75
  Bottom 0.15: 12.83,21.59 12.83,17.53 11.94,16.64
  Bottom 0.152: 12.83,21.59 13.49,22.25 13.49,30.13 v15.11,31.75 | 11.94,16.64 10.41,16.64 10.03,16.26 SDA1.1
N$4  (via drill 0.2)
  Top 0.152: U1.58 14.9,30.73 v15.11,30.73
  Bottom 0.15: 13.21,15.37 13.21,21.3
  Bottom 0.152: 13.21,15.37 12.83,14.99 SCL1.1 | v15.11,30.73 15.11,30.61 15.24,30.48 15.24,23.33 13.21,21.3
N$5  (via drill 0.2)
  Top 0.152: J1.7 11.86,4.13 11.43,4.56 v11.43,4.57 4.95,11.05 4.95,21.31 3.3,22.96 v3.3,29.72 | U1.39 2.75,30.61 v2.67,30.61
  Bottom 0.152: v11.43,4.57 10.79,5.21 R1.1 | v3.3,29.72 2.67,30.35 v2.67,30.61
N$6  (via drill 0.2)
  Top 0.152: J1.8 11.45,3.03 v11.43,3.05 4.7,9.77 4.7,10.93 4.7,21.21 2.54,23.37 2.54,29.69 U1.40
  Bottom 0.152: v11.43,3.05 R2.1
N$7  (via drill 0.2)
  Top 0.152: v11.43,10.67 13.33,10.67 J1.1 13.39,12.14 12.7,12.83 12.7,27.99 U1.51
  Bottom 0.152: v11.43,10.67 R3.1
N$8  (via drill 0.2)
  Top 0.152: v11.43,9.14 11.91,9.63 J1.2 14.14,9.63 14.77,10.25 14.77,11.52 12.95,13.33 12.95,28.31 11.31,29.96 U1.52
  Bottom 0.152: v11.43,9.14 R4.1
N$9  (via drill 0.2)
  Top 0.152: v11.43,7.62 12.34,8.53 J1.3 14.27,8.53 15.15,9.41 15.15,11.62 13.26,13.52 13.26,29.55 U1.54
  Bottom 0.152: R5.1 v11.43,7.62
N$10  (via drill 0.2)
  Top 0.152: U1.29 2.48,38.92 2.48,39.44 v3.81,40.77 | TEMP.19 5.6,23.23 v4.83,23.75
  Bottom 0.152: v3.81,40.77 3.81,29.34 4.83,28.32 4.83,27.56 | 4.83,27.56 v4.83,23.75 | R7.2 3.94,26.67 4.83,27.56
N$11  (via drill 0.2)
  Top 0.152: U1.30 1.62,39.07 1.62,40.35 v1.65,40.39 | v5.46,22.61 5.49,22.58 TEMP.20
  Bottom 0.152: v1.65,40.39 3,41.74 4.31,41.74 4.67,41.38 4.67,40.49 4.19,40.01 4.19,29.59 5.46,28.32 v5.46,22.61 4.19,22.61 3.39,23.41 R6.2
N$12
  Top 0.152: U1.21 6.8,40.25 7.1,40.25 8.39,41.54 ACCEL.2
N$14
  Top 0.152: U1.22 6.58,39.77 7.11,39.77 9.39,42.05 ACCEL.4
N$15  (via drill 0.2)
  Top 0.152: ACCEL.3 v8.89,43.31 | U1.23 6.35,39.29 7.41,39.29 v8.89,40.77
  Bottom 0.152: v8.89,43.31 v8.89,40.77
N$17  (via drill 0.2)
  Top 0.152: U1.20 4.57,43.19 4.57,44.45 v4.7,44.58 | v11.05,44.58 10.34,44.58 ACCEL.5
  Bottom 0.152: v4.7,44.58 v11.05,44.58
N$18  (via drill 0.2)
  Top 0.152: J1.5 12.34,6.33 11.88,5.87 11.23,5.87 10.82,6.28 10.82,11.12 12.45,12.74 12.45,26.8 v11.3,27.94 | U1.53 12.7,29.4 v12.7,29.34
  Bottom 0.152: v11.3,27.94 v12.7,29.34
N$19  (via drill 0.2)
  Top 0.152: U1.60 13.46,33.59 13.46,34.16 v13.59,34.29
  Bottom 0.152: v13.59,34.29 12.07,32.77 R12.1
N$20  (via drill 0.2)
  Top 0.152: STAT.A 14.19,25.75 v13.97,25.53
  Bottom 0.152: R43.2 14.39,25.95 v13.97,25.53
N$21  (via drill 0.2)
  Top 0.152: U1.62 16.26,32.21 v16.26,32.13
  Bottom 0.152: R43.1 17.12,27.83 17.12,31.27 v16.26,32.13
N$22  (via drill 0.2)
  Top 0.152: U1.61 15.75,32.01 15.75,31.75 v16.51,30.99
  Bottom 0.152: R45.1 16.09,30.57 v16.51,30.99
N$23  (via drill 0.2)
  Top 0.102: U1.5 16.54,40.86 16.54,43.86 16.2,44.2 14.64,44.2 13.93,44.91 CLOCK.3 13.93,46.39 v13.72,46.61
  Bottom 0.102: C17.1 13.86,46.47 v13.72,46.61
N$24
  Bottom 0.152: PWR.2 3.22,67.4 2.16,68.45 B+.1
N$25
  Top 0.152: U2.6 12.5,54.27 12.21,53.97 11.44,53.97 C3.1
  Top 0.254: C3.1
N$26
  Top 0.152: C3.2 12.3,53.34 13.15,54.19 U2.7
N$27  (via drill 2.1)
  other vias: 2.54,19.18
N$28  (via drill 2.1)
  other vias: 2.54,48.39
N$29  (via drill 2.1)
  other vias: 15.24,48.39
N$30  (via drill 2.1)
  other vias: 15.24,19.18
N$31  (via drill 0.2)
  Top 0.152: v6.35,47.12 6.49,46.98 ACCEL.14
  Bottom 0.152: C5.1 7.06,45.85 6.35,46.99 v6.35,47.12
N$33  (via drill 0.2)
  Top 0.127: U1.31 1.5,38.48 v1.4,38.48
  Bottom 0.127: C12.1 2.02,39.1 v1.4,38.48
N$34  (via drill 0.2)
  Top 0.127: v6.35,26.8 6.32,26.8 5.5,27.62 5.5,28.26 5.9,28.66 6.46,28.66 U1.47
  Bottom 0.152: C11.1 v6.35,26.8
N$36
  Bottom 0.127: U$2.5 1.27,57.17 R10.1
N$37
  Top 0.152: R13.1 R11.2 4.28,45.72 4.95,45.72 6.35,44.32 6.35,43.56 7.53,42.38 U1.17
N$38  (via drill 0.35)
  Top 0.152: v0.76,51.94 0.76,68.2 2.46,69.9 PWR.3
  Bottom 0.127: 6.12,58.18 6.12,54.76 5.92,54.56 U$2.3
  Bottom 0.152: 0.78,51.96 v0.76,51.94 1.4,51.31 5.46,51.31 5.97,51.82 5.97,53.8 5.21,54.56 U$2.3
  Bottom 0.254: 6.03,58.11 C14.1 6.12,58.18
N$39  (via drill 0.2)
  Top 0.102: U1.6 15.57,40.6 15.57,41.71 v15.49,41.78 15.49,43.18 CLOCK.1
  Bottom 0.102: v15.49,41.78 15.49,43.32 C16.1
N$40
  Top 0.152: USB.B6 8.22,57.7 USB.A6
  Bottom 0.152: USB.A6 10.33,57.7 11.18,58.55 R8.1
N$41
  Bottom 0.152: R14.1 13.55,62.66 CHRG.C
N$42  (via drill 0.2)
  Top 0.152: U1.10 9.96,37.82 8.69,37.82 5.08,34.21 v5.08,33.53
  Bottom 0.152: SDO.1 10.54,28.96 9.78,29.72 5.46,29.72 5.08,30.1 v5.08,33.53
N$43  (via drill 0.2)
  Top 0.152: U1.11 9.66,38.23 8.38,38.23 v5.08,34.92
  Bottom 0.152: v5.08,34.92 5.08,34.21 4.6,33.73 4.6,29.71 5.03,29.28 9.24,29.28 9.6,28.92 9.6,22.66 9.78,22.48 SDI.1
N$44  (via drill 0.2)
  Top 0.152: v1.02,32.77 1.42,33.17 1.77,33.17 U1.34
  Bottom 0.152: v1.02,32.77 0.91,32.66 0.91,24 4.09,20.83 CLK.1
N$46
  Bottom 0.127: USB.B5 8.11,55.27 8.11,54.1 8.39,53.81 12.45,53.81 12.64,54 12.64,55.73 12.36,56.01 R24.2
N$47
  Bottom 0.152: USB.A5 9.98,58.55 11.25,59.82 R23.2
N$51  (via drill 0.2)
  Top 0.152: RDY.A 14.19,28.32 13.97,28.1 v13.97,28.07
  Bottom 0.152: R45.2 14.39,28.49 v13.97,28.07
N$52
  Bottom 0.152: USB.B7 7.75,57.7 8.6,56.85 USB.A7 | 8.98,56.85 8.72,57.11 USB.A7 | USB.A7 10.63,56.85 11.05,57.28 R15.1
N$71  (via drill 0.2)
  Top 0.152: J1.9 1.56,3.85 v3.05,5.33 3.09,5.33 4.4,6.65 4.4,21.15 2.03,23.52 2.03,30.72 3.87,32.56 U1.38
  Bottom 0.152: R26.1 3.05,3.09 v3.05,5.33
RST  (via drill 0.2, 0.35)
  Top 0.127: 13.05,49.02 16.51,52.48 16.51,65.85 16.13,66.23 v16.13,66.29 | SWD.3 11.56,69.17 10.67,70.06 8.97,70.06 7.62,68.71 v7.62,67.44
  Top 0.15: 14.11,39.85 14.11,40.92 12.57,42.46 12.57,47.12 13.05,47.59 13.05,49.02
  Top 0.152: 14.11,39.85 U1.7 11.6,37.34 v8.89,37.34
  Bottom 0.127: v7.62,67.44 10.16,64.9 14.73,64.9 v16.13,66.29
  Bottom 0.15: R36.1 9.69,35.85 9.84,36
  Bottom 0.152: 9.84,36 10.16,36.33 RST.2 9.9,36.33 v8.89,37.34 | C37.1 R36.1
SWCLK  (via drill 0.2)
  Top 0.127: 13.36,47.73 13.36,48.94 16.75,52.33 16.75,69.57 16.26,70.06 13.84,70.06 12.93,69.15 SWD.4
  Top 0.15: 13.36,47.73 13.36,47.48 12.83,46.95 12.83,42.67
  Top 0.152: v14.61,40.39 14.61,40.89 12.83,42.67 | U1.49 8.89,30.38 8.89,31.24 v13.08,35.43
  Bottom 0.152: v14.61,40.39 14.61,36.96 v13.08,35.43
SWDIO
  Top 0.127: 16.95,37.78 16.95,38.39 17.13,38.57 17.13,72.74 16.64,73.23 14.09,73.23 13.19,72.33 13.19,70.78 SWD.2
  Top 0.152: U1.46 7.97,30.88 7.97,31.89 12.14,36.07 15.24,36.07 16.95,37.78 17.12,37.95
SWO  (via drill 0.2)
  Top 0.127: SWD.6 13.25,67.46 13.56,67.46 16.15,64.87 16.15,52.72
  Top 0.152: 16.15,52.72 12.32,48.89 v12.32,47.62 | U1.55 11.69,31.83 11.69,33.28 13.84,35.43 v14.1,35.43
  Bottom 0.15: 12.32,44.58 11.81,44.07 11.81,41.53 12.19,41.15 14.73,41.15 15.47,40.41
  Bottom 0.152: v14.1,35.43 14.1,35.58 15.47,36.95 15.47,40.41 | v12.32,47.62 12.32,44.58
USB_DM  (via drill 0.2, 0.35)
  Top 0.102: U1.35 1.52,32.21 v1.52,32.13
  Top 0.127: v15.24,57.28 15.24,52.82 12.71,50.29 9.91,50.29 9.4,50.8 v1.78,50.8
  Bottom 0.102: v1.78,50.8 1.14,50.8 0.81,50.48 0.81,33.98 1.52,33.27 v1.52,32.13
  Bottom 0.152: R15.2 v15.24,57.28
USB_DP  (via drill 0.2, 0.35)
  Top 0.102: U1.36 2.41,32.39 2.41,31.88 v2.03,31.5
  Top 0.127: v4.45,49.78 12.83,49.78 15.8,52.76 15.8,57.99 v15.24,58.55
  Bottom 0.102: v2.03,31.5 2.39,31.85 2.76,31.85 3.35,32.44 3.35,39.62 3.18,39.8 1.34,39.8 1.2,39.94 1.2,44.12 4.5,47.42 4.5,49.48 4.32,49.66 v4.45,49.78
  Bottom 0.152: R8.2 v15.24,58.55
V+  (via drill 0.2, 0.35)
  Top 0.152: v5.08,46.74 3.94,46.74 2.03,44.83 R11.1 | U2.3 U2.2 | v15.24,61.09 15.11,60.96 C1.1
  Top 0.254: U2.2 13.15,60.54 C1.1 13.57,62.36 12.96,62.97 6.75,62.97 5.46,64.26 PWR.1
  Bottom 0.152: v5.08,46.74 5.08,48.42 C13.1 7.71,49.78 9.11,51.18 15.29,51.18 D5.1 16.18,60.33 15.42,61.09 v15.24,61.09
  Bottom 0.254: C13.1 7.16,49.78

### Text on the board
tNames: CHRG | ON | PITOT CTRL / HELVETIA 2022 / Linus Stöckli